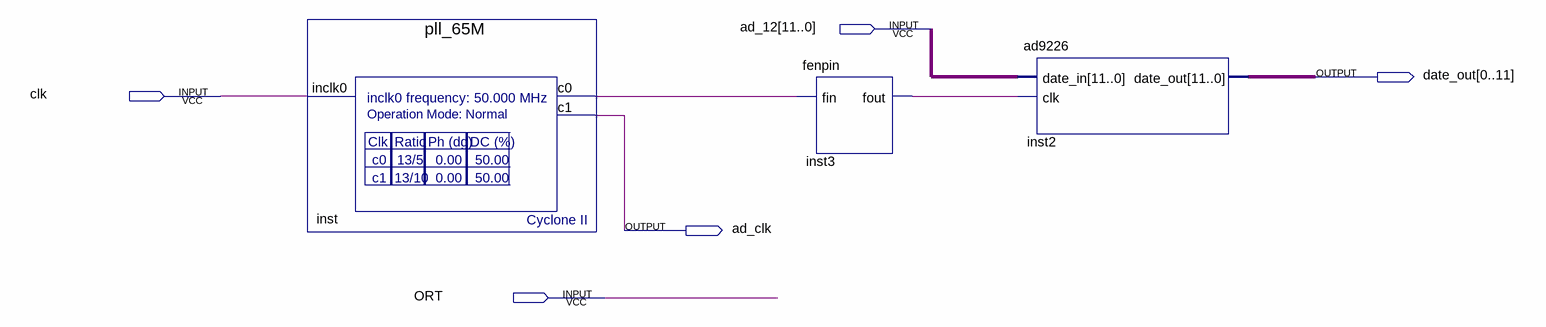
[diagram p0: schematic sheet]
// Quartus schematic ad9226_1.bdf as structural Verilog: 3 symbols, 5 pins
module ad9226_1 (
  input  [11:0] ad_12,
  input  clk,
  input  ORT,
  output [0:11] date_out,
  output ad_clk
);

  wire inst3_fout, inst_c0;

  pll_65M inst (.inclk0(clk), .c0(inst_c0), .c1(ad_clk));
  fenpin inst3 (.fin(inst_c0), .fout(inst3_fout));
  ad9226 inst2 (.date_in(ad_12), .clk(inst3_fout), .date_out(date_out));
endmodule
